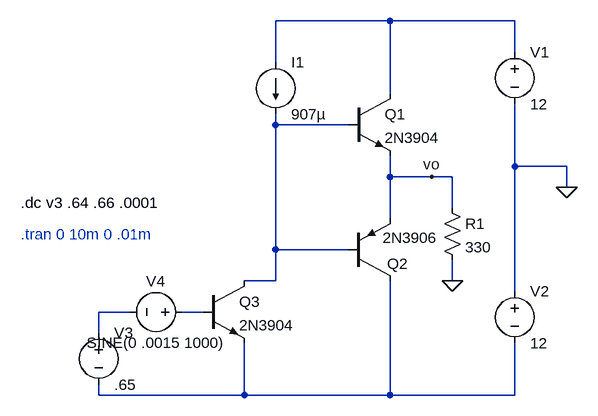
[diagram p0: schematic teoria3.asc]
teoria3.asc, the LTspice schematic file:
Version 4
SHEET 1 880 680
WIRE 256 -32 80 -32
WIRE 448 -32 256 -32
WIRE 448 16 448 -32
WIRE 80 32 80 -32
WIRE 256 80 256 -32
WIRE 80 128 80 112
WIRE 192 128 80 128
WIRE 448 192 448 96
WIRE 528 192 448 192
WIRE 256 208 256 176
WIRE 320 208 256 208
WIRE 352 208 320 208
WIRE 528 224 528 192
WIRE 352 256 352 208
WIRE 256 272 256 208
WIRE 80 320 80 128
WIRE 192 320 80 320
WIRE 80 368 80 320
WIRE 80 368 32 368
WIRE 352 368 352 336
WIRE 448 384 448 192
WIRE -144 416 -192 416
WIRE -32 416 -64 416
WIRE -192 448 -192 416
WIRE -192 544 -192 528
WIRE 32 544 32 464
WIRE 32 544 -192 544
WIRE 256 544 256 368
WIRE 256 544 32 544
WIRE 448 544 448 464
WIRE 448 544 256 544
FLAG 352 368 0
FLAG 528 224 0
FLAG 320 208 vo
SYMBOL npn 192 80 R0
SYMATTR InstName Q1
SYMATTR Value 2N3904
SYMBOL pnp 192 368 M180
WINDOW 0 60 26 Left 2
WINDOW 3 53 66 Left 2
SYMATTR InstName Q2
SYMATTR Value 2N3906
SYMBOL voltage 448 0 R0
WINDOW 123 0 0 Left 0
WINDOW 39 0 0 Left 0
SYMATTR InstName V1
SYMATTR Value 12
SYMBOL voltage 448 368 R0
WINDOW 123 0 0 Left 0
WINDOW 39 0 0 Left 0
SYMATTR InstName V2
SYMATTR Value 12
SYMBOL npn -32 368 R0
SYMATTR InstName Q3
SYMATTR Value 2N3904
SYMBOL res 336 240 R0
SYMATTR InstName R1
SYMATTR Value 330
SYMBOL voltage -192 432 R0
WINDOW 123 0 0 Left 0
WINDOW 39 0 0 Left 0
SYMATTR InstName V3
SYMATTR Value .65
SYMBOL current 80 32 R0
WINDOW 123 0 0 Left 0
WINDOW 39 0 0 Left 0
SYMATTR InstName I1
SYMATTR Value 907µ
SYMBOL voltage -48 416 R90
WINDOW 0 -32 56 VBottom 2
WINDOW 3 32 56 VTop 2
WINDOW 123 0 0 Left 0
WINDOW 39 0 0 Left 0
SYMATTR InstName V4
SYMATTR Value SINE(0 .0015 1000)
TEXT -312 248 Left 2 !.dc v3 .64 .66 .0001
TEXT -312 296 Left 2 ;.tran 0 10m 0 .01m

The netlist it stands for:
* teoria3.asc
Q1 N001 N002 vo 0 2N3904
Q2 N005 N002 vo 0 2N3906
V1 N001 0 12
V2 0 N005 12
Q3 N002 N004 N005 0 2N3904
R1 vo 0 330
V3 N003 N005 .65
I1 N001 N002 907µ
V4 N004 N003 SINE(0 .0015 1000)
.model NPN NPN
.model PNP PNP
.lib standard.bjt
.dc v3 .64 .66 .0001
* .tran 0 10m 0 .01m
.backanno
.end